# EAGLE design Bleep_Drum_Eurorack (EAGLE 7.5.0)
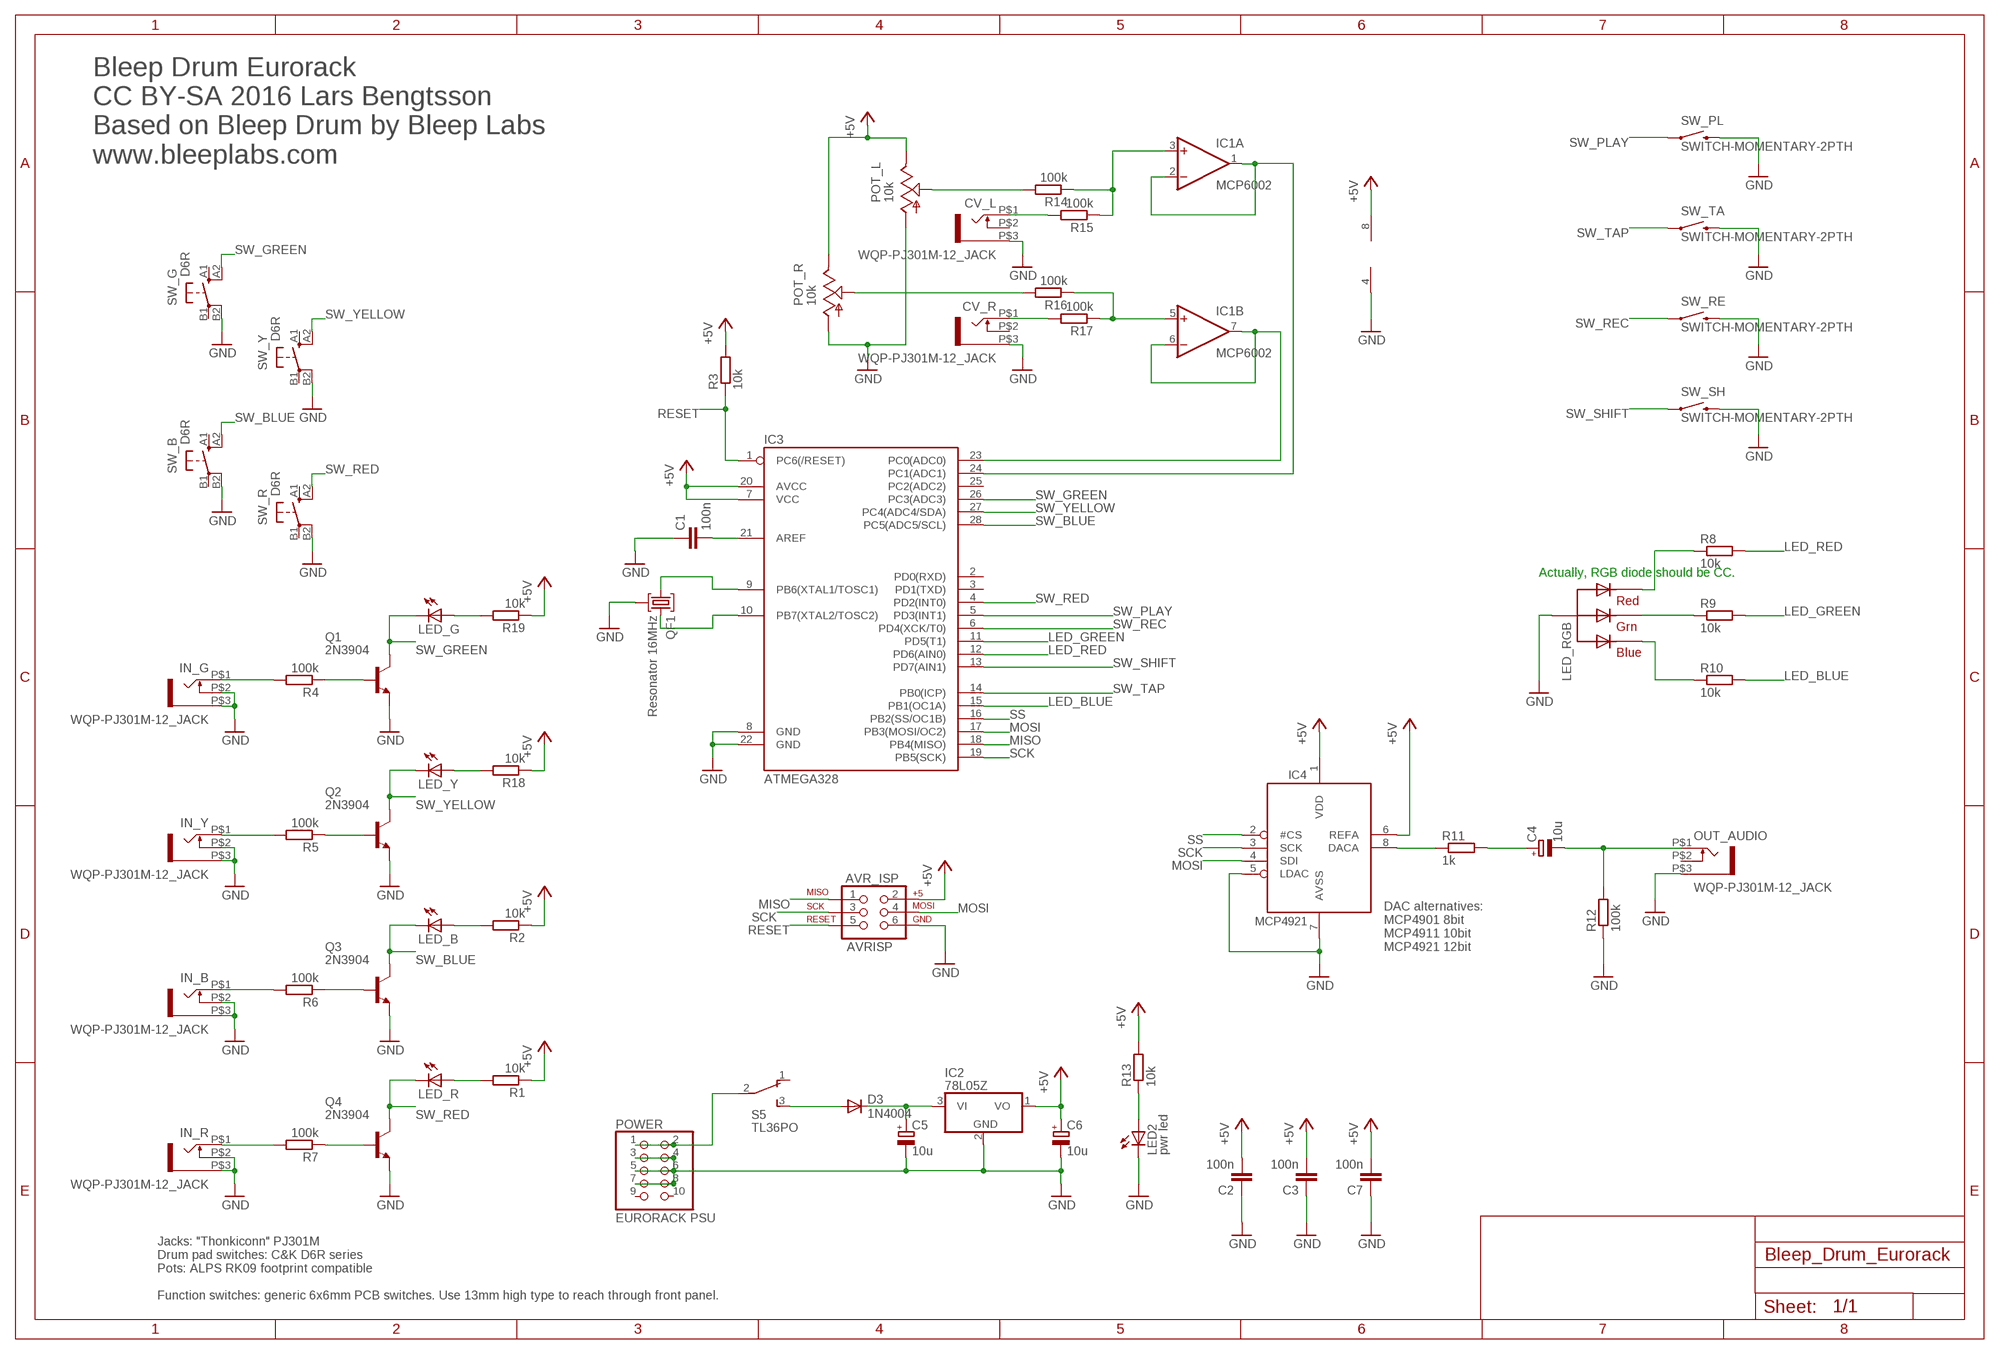
[diagram p0: schematic, sheet 1]

## Parts
AVR_ISP  AVRISP  AVR_SPI_PRG_6PTH  [2X3]
C1  100n  C-EU025-025X050  [C025-025X050]
C2  100n  C-EU025-025X050  [C025-025X050]
C3  100n  C-EU025-025X050  [C025-025X050]
C4  10u  CPOL-EUE2.5-5  [E2,5-5]
C5  10u  CPOL-EUE2.5-5  [E2,5-5]
C6  10u  CPOL-EUE2.5-5  [E2,5-5]
C7  100n  C-EU025-025X050  [C025-025X050]
CV_L  WQP-PJ301M-12_JACK  [WQP-PJ301M-12_JACK]
CV_R  WQP-PJ301M-12_JACK  [WQP-PJ301M-12_JACK]
D3  1N4004  DIODE-D-2.5  [D-2.5]
IC1  MCP6002  TL072P  [DIL08]
IC2  78L05Z  [TO92]
IC3  ATMEGA328  ATMEGA328P_PDIP  [DIL28-3]
IC4  MCP4921  MCP4921DIP8  [DIL08]
IN_B  WQP-PJ301M-12_JACK  [WQP-PJ301M-12_JACK]
IN_G  WQP-PJ301M-12_JACK  [WQP-PJ301M-12_JACK]
IN_R  WQP-PJ301M-12_JACK  [WQP-PJ301M-12_JACK]
IN_Y  WQP-PJ301M-12_JACK  [WQP-PJ301M-12_JACK]
LED2  pwr led  LED3MM  [LED3MM]
LED_B  LED3MM  [LED3MM]
LED_G  LED3MM  [LED3MM]
LED_R  LED3MM  [LED3MM]
LED_RGB  RGBLED_CA-5MM  [LED5MMRGB]
LED_Y  LED3MM  [LED3MM]
OUT_AUDIO  WQP-PJ301M-12_JACK  [WQP-PJ301M-12_JACK]
POT_L  10k  POT_USVERTICAL  [ALPS_POT_VERTICAL]
POT_R  10k  POT_USVERTICAL  [ALPS_POT_VERTICAL]
POWER  EURORACK PSU  PINHD-2X5  [2X05]
Q1  2N3904  [TO92]
Q2  2N3904  [TO92]
Q3  2N3904  [TO92]
Q4  2N3904  [TO92]
QF1  Resonator 16MHz  90M15AUM1  [UM1]
R1  10k  R-EU_0204/2V  [0204V]
R2  10k  R-EU_0204/2V  [0204V]
R3  10k  R-EU_0204/2V  [0204V]
R4  100k  R-EU_0204/2V  [0204V]
R5  100k  R-EU_0204/2V  [0204V]
R6  100k  R-EU_0204/2V  [0204V]
R7  100k  R-EU_0204/2V  [0204V]
R8  10k  R-EU_0204/2V  [0204V]
R9  10k  R-EU_0204/2V  [0204V]
R10  10k  R-EU_0204/2V  [0204V]
R11  1k  R-EU_0204/2V  [0204V]
R12  100k  R-EU_0204/2V  [0204V]
R13  10k  R-EU_0204/2V  [0204V]
R14  100k  R-EU_0204/2V  [0204V]
R15  100k  R-EU_0204/2V  [0204V]
R16  100k  R-EU_0204/2V  [0204V]
R17  100k  R-EU_0204/2V  [0204V]
R18  10k  R-EU_0204/2V  [0204V]
R19  10k  R-EU_0204/2V  [0204V]
S5  TL36PO  [TL3XPO]
SW_B  D6R  [D6R]
SW_G  D6R  [D6R]
SW_PL  SWITCH-MOMENTARY-2PTH  [TACTILE-PTH]
SW_R  D6R  [D6R]
SW_RE  SWITCH-MOMENTARY-2PTH  [TACTILE-PTH]
SW_SH  SWITCH-MOMENTARY-2PTH  [TACTILE-PTH]
SW_TA  SWITCH-MOMENTARY-2PTH  [TACTILE-PTH]
SW_Y  D6R  [D6R]

## Nets
+5V: AVR_ISP.2 C2.2 C3.2 C6.+ C7.2 IC1.8(P:V+) IC2.1(VO) IC3.7(VCC) IC3.20(AVCC) IC4.1(VDD) IC4.6(REFA) POT_L.P$1(E) POT_R.P$1(E) R1.1 R2.1 R3.2 R13.2 R18.1 R19.1
+12V_IN: POWER.1 POWER.2 S5.2(P)
GND: AVR_ISP.6 C1.1 C2.1 C3.1 C5.- C6.- C7.1 CV_L.P$3 CV_R.P$3 IC1.4(P:V-) IC2.2(GND) IC3.8(GND) IC3.22(GND) IC4.5(LDAC) IC4.7(AVSS) IN_B.P$2 IN_B.P$3 IN_G.P$2 IN_G.P$3 IN_R.P$2 IN_R.P$3 IN_Y.P$2 IN_Y.P$3 LED2.K(C) LED_RGB.2(VCC) OUT_AUDIO.P$3 POT_L.P$3(A) POT_R.P$3(A) POWER.3 POWER.4 POWER.5 POWER.6 POWER.7 POWER.8 Q1.3(E) Q2.3(E) Q3.3(E) Q4.3(E) QF1.2 R12.1 SW_B.B2(P1) SW_G.B2(P1) SW_PL.3 SW_R.B2(P1) SW_RE.3 SW_SH.3 SW_TA.3 SW_Y.B2(P1)
LED_BLUE: IC3.15(PB1(OC1A)) R10.2
LED_GREEN: IC3.11(PD5(T1)) R9.2
LED_RED: IC3.12(PD6(AIN0)) R8.2
MISO: AVR_ISP.1 IC3.18(PB4(MISO))
MOSI: AVR_ISP.4 IC3.17(PB3(MOSI/OC2)) IC4.4(SDI)
N$1: C4.+ R11.2
N$2: IC4.8(DACA) R11.1
N$3: C4.- OUT_AUDIO.P$1 R12.2
N$4: C5.+ D3.C IC2.3(VI)
N$5: IC3.9(PB6(XTAL1/TOSC1)) QF1.1
N$6: IC3.10(PB7(XTAL2/TOSC2)) QF1.3
N$7: LED_RGB.1(RED) R8.1
N$8: C1.2 IC3.21(AREF)
N$9: IN_Y.P$1 R5.2
N$10: Q2.2(B) R5.1
N$11: LED_R.A R1.2
N$12: IC1.1(A:OUT) IC1.2(A:-IN) IC3.24(PC1(ADC1))
N$13: LED_RGB.3(GREEN) R9.1
N$14: Q1.2(B) R4.1
N$15: IN_G.P$1 R4.2
N$16: LED_RGB.4(BLUE) R10.1
N$17: D3.A S5.3(S)
N$18: Q3.2(B) R6.1
N$19: IN_B.P$1 R6.2
N$20: IN_R.P$1 R7.2
N$21: Q4.2(B) R7.1
N$22: LED2.A R13.1
N$23: LED_B.A R2.2
N$24: LED_Y.A R18.2
N$25: LED_G.A R19.2
N$26: POT_L.P$2(S) R14.2
N$27: IC1.3(A:+IN) R14.1 R15.1
N$28: CV_L.P$1 R15.2
N$29: POT_R.P$2(S) R16.2
N$30: IC1.5(B:+IN) R16.1 R17.1
N$31: CV_R.P$1 R17.2
N$33: IC1.6(B:-IN) IC1.7(B:OUT) IC3.23(PC0(ADC0))
RESET: AVR_ISP.5 IC3.1(PC6(/RESET)) R3.1
SCK: AVR_ISP.3 IC3.19(PB5(SCK)) IC4.3(SCK)
SS: IC3.16(PB2(SS/OC1B)) IC4.2(#CS)
SW_BLUE: IC3.28(PC5(ADC5/SCL)) LED_B.K(C) Q3.1(C) SW_B.A2(S1)
SW_GREEN: IC3.26(PC3(ADC3)) LED_G.K(C) Q1.1(C) SW_G.A2(S1)
SW_PLAY: IC3.5(PD3(INT1)) SW_PL.1
SW_REC: IC3.6(PD4(XCK/T0)) SW_RE.1
SW_RED: IC3.4(PD2(INT0)) LED_R.K(C) Q4.1(C) SW_R.A2(S1)
SW_SHIFT: IC3.13(PD7(AIN1)) SW_SH.1
SW_TAP: IC3.14(PB0(ICP)) SW_TA.1
SW_YELLOW: IC3.27(PC4(ADC4/SDA)) LED_Y.K(C) Q2.1(C) SW_Y.A2(S1)
Unconnected: CV_L.P$2 CV_R.P$2 IC3.2(PD0(RXD)) IC3.3(PD1(TXD)) IC3.25(PC2(ADC2)) OUT_AUDIO.P$2 POWER.9 POWER.10 S5.1(O) SW_B.A1(S) SW_B.B1(P) SW_G.A1(S) SW_G.B1(P) SW_R.A1(S) SW_R.B1(P) SW_Y.A1(S) SW_Y.B1(P)

## Notes on the sheet
- Bleep Drum Eurorack
  CC BY-SA 2016 Lars Bengtsson
  Based on Bleep Drum by Bleep Labs
  www.bleeplabs.com
- Actually, RGB diode should be CC.
- DAC alternatives:
  MCP4901 8bit
  MCP4911 10bit
  MCP4921 12bit
- Jacks: "Thonkiconn" PJ301M
  Drum pad switches: C&K D6R series
  Pots: ALPS RK09 footprint compatible
  
  Function switches: generic 6x6mm PCB switches. Use 13mm high type to reach through front panel.

## Library data of the parts
AVR_ISP = SparkFun:AVR_SPI_PRG_6: AVR ISP 6 Pin This is the reduced ISP connector for AVR programming. Common on Arduino. This footprint will take up less PCB space and can be used with a 10-pin to 6-pin adapter such as SKU: BOB-08508
C1-C3 C7 = rcl:C-EU: CAPACITOR, European symbol
C4-C6 = rcl:CPOL-EU: POLARIZED CAPACITOR, European symbol
CV_L CV_R IN_B IN_G IN_R IN_Y OUT_AUDIO = thonkiconn:WQP-PJ301M-12_JACK
D3 = diode:DIODE-: DIODE
IC1 = linear:TL072: OP AMP
IC2 = linear:78*: Positive VOLTAGE REGULATOR Source: http://cache.national.com/ds/LM/LM78L05.pdf http://www.fairchildsemi.com/ds/LM/LM7805.pdf
IC3 = SparkFun-DigitalIC:ATMEGA328P_PDIP: uC used in the Arduino 32kb flash, 1k EEPROM, 2k SRAM This is the through-hole version of this chip.
IC4 = adafruit_mcp:MCP4921
LED2 LED_B LED_G LED_R LED_Y = led:LED: LED OSRAM: - CHIPLED LG R971, LG N971, LY N971, LG Q971, LY Q971, LO R971, LY R971 LH N974, LH R974 LS Q976, LO Q976, LY Q976 LO Q996 - Hyper CHIPLED LW Q18S LB Q993, LB Q99A, LB R99A - SideLED LS A670, LO A670, LY A670, LG A670, LP A670 LB A673, LV A673, LT A673, LW A673 LH A674 LY A675 LS A676, LA A676, LO A676, LY A676, LW A676 LS A679, LY A679, LG A679 - Hyper Micro SIDELED® LS Y876, LA Y876, LO Y876, LY Y876 LT Y87S - SmartLED LW L88C, LW L88S LB L89C, LB L89S, LG L890 LS L89K, LO L89K, LY L89K LS L896, LA L896, LO L896, LY L896 - TOPLED LS T670, LO T670, LY T670, LG T670, LP T670 LSG T670, LSP T670, LSY T670, LOP T670, LYG T670 LG T671, LOG T671, LSG T671 LB T673, LV T673, LT T673, LW T673 LH T674 LS T676, LA T676, LO T676, LY T676, LB T676, LH T676, LSB T676, LW T676 LB T67C, LV T67C, LT T67C, LS T67K, LO T67K, LY T67K, LW E67C LS E67B, LA E67B, LO E67B, LY E67B, LB E67C, LV E67C, LT E67C LW T67C LS T679, LY T679, LG T679 LS T770, LO T770, LY T770, LG T770, LP T770 LB T773, LV T773, LT T773, LW T773 LH T774 LS E675, LA E675, LY E675, LS T675 LS T776, LA T776, LO T776, LY T776, LB T776 LHGB T686 LT T68C, LB T68C - Hyper Mini TOPLED® LB M676 - Mini TOPLED Santana® LG M470 LS M47K, LO M47K, LY M47K Source: http://www.osram.convergy.de LUXEON: - LUMILED® LXK2-PW12-R00, LXK2-PW12-S00, LXK2-PW14-U00, LXK2-PW14-V00 LXK2-PM12-R00, LXK2-PM12-S00, LXK2-PM14-U00 LXK2-PE12-Q00, LXK2-PE12-R00, LXK2-PE12-S00, LXK2-PE14-T00, LXK2-PE14-U00 LXK2-PB12-K00, LXK2-PB12-L00, LXK2-PB12-M00, LXK2-PB14-N00, LXK2-PB14-P00, LXK2-PB14-Q00 LXK2-PR12-L00, LXK2-PR12-M00, LXK2-PR14-Q00, LXK2-PR14-R00 LXK2-PD12-Q00, LXK2-PD12-R00, LXK2-PD12-S00 LXK2-PH12-R00, LXK2-PH12-S00 LXK2-PL12-P00, LXK2-PL12-Q00, LXK2-PL12-R00 Source: www.luxeon.com KINGBRIGHT: KA-3528ASYC Source: www.kingbright.com
LED_RGB = adafruit:RGBLED_CA: RGB LED, common-anode 5MM Staggered pins 5mm Piranha package http://www.ladyada.net/library/pcb/eaglelibrary.html
POT_L POT_R = pot-alps:POT_US
POWER = pinhead:PINHD-2X5: PIN HEADER
Q1-Q4 = transistor-npn:2N3904: NPN Transistor
QF1 = crystal:90M15A: Monolithic Crystal Filters Source: www.vanlong.com; OC_FARNELL: unknown; OC_NEWARK: unknown
R1-R19 = rcl:R-EU_: RESISTOR, European symbol
S5 = switch:TL36PO: TINY SWITCH ON - ON Source: http://www2.produktinfo.conrad.com/datenblaetter/700000-724999/705152-da-01-de-Subminiaturschalter_TL_36YO.pdf
SW_B SW_G SW_R SW_Y = og-switch-CK_D6R:D6R: C&K D6R
SW_PL SW_RE SW_SH SW_TA = SparkFun-Electromechanical:SWITCH-MOMENTARY-2: Various NO switches- pushbuttons, reed, etc; PROD_ID: SWCH-08441

## Board
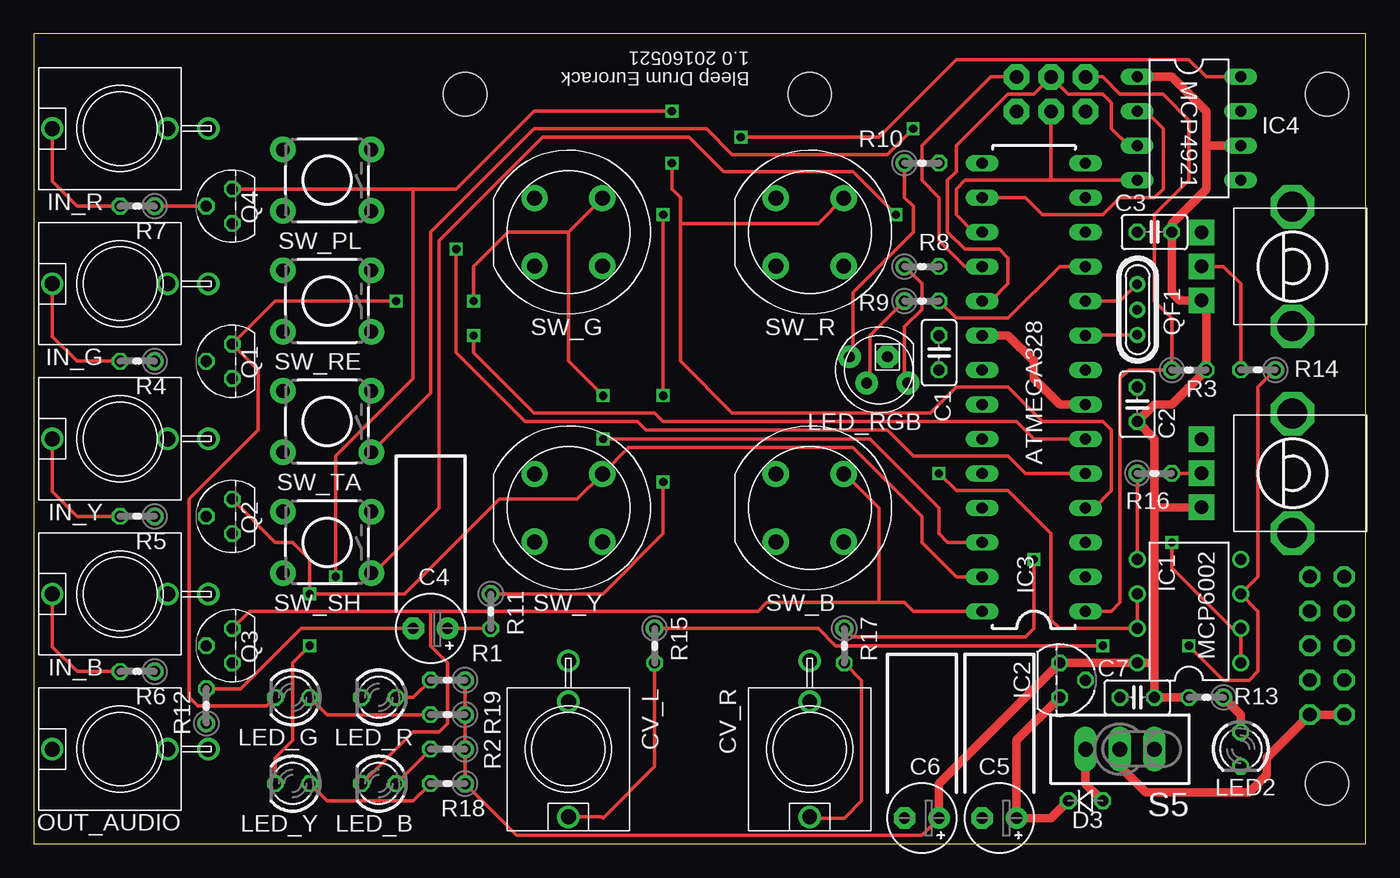
[diagram p1: board, top side]
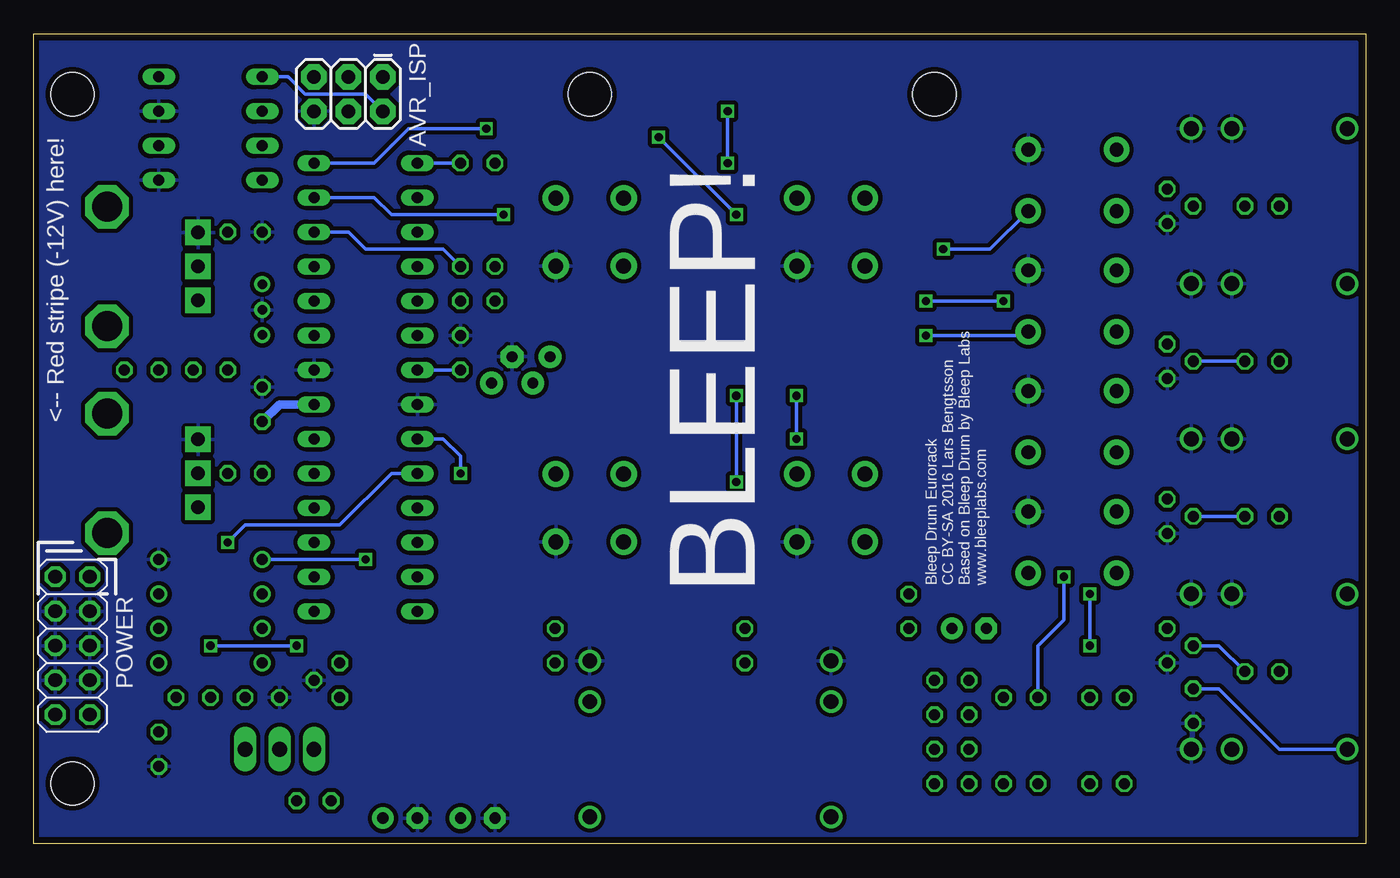
[diagram p2: board, bottom side, seen from below]

Size 98.09 x 59.68 mm. Coordinates in mm from the lower left corner, seen from the top.
Outline: 0,0 98.09,0 98.09,59.68 0,59.68 0,0
Copper layers (1*16): Top 0.0356mm / dielectric 1.5011mm / Bottom 0.0356mm
Design rules "LaenPCBOrder": minimum track width 6mil, minimum drill 13mil, track to track 6mil, track to pad 6mil, pad to pad 6mil, via to via 6mil, smd to smd 6mil, copper to edge 15mil, drill to drill 6mil, minimum pad ring 7mil, minimum via ring 7mil, stop-mask expansion 3mil, vias tented up to drill 0mil, thermal gap 10mil
Holes 3.2 mm at 31.75,55.25 57.15,55.25 95.25,4.45 95.25,55.25

### Footprints (pad centres in the part's own frame; a part is rotated, then mirrored left to right if it is on the bottom)
2X3 = drill 1.016 pad 1.88 octagon: 1 0,0; 2 0,2.54; 3 2.54,0; 4 2.54,2.54; 5 5.08,0; 6 5.08,2.54
C025-025X050 = drill 0.813 octagon: 1 -1.27,0; 2 1.27,0
E2,5-5 = drill 0.813 pad 1.6: + -1.27,0 | drill 0.813 pad 1.6 octagon: - 1.27,0
WQP-PJ301M-12_JACK = drill 1.1: P$1 0,5; P$2 0,-3.5; P$3 0,-6.5
D-2.5 = drill 0.813 octagon: A 1.27,0; C -1.27,0
DIL08 = drill 0.813 pad 1.27: 1 -3.81,-3.81; 2 -1.27,-3.81; 3 1.27,-3.81; 4 3.81,-3.81; 5 3.81,3.81; 6 1.27,3.81; 7 -1.27,3.81; 8 -3.81,3.81
TO92 = drill 0.813 octagon: 1 -1.27,0; 2 0,1.905; 3 1.27,0
DIL28-3 = drill 0.813 long: 1 -16.51,-3.81; 2 -13.97,-3.81; 3 -11.43,-3.81; 4 -8.89,-3.81; 5 -6.35,-3.81; 6 -3.81,-3.81; 7 -1.27,-3.81; 8 1.27,-3.81; 9 3.81,-3.81; 10 6.35,-3.81; 11 8.89,-3.81; 12 11.43,-3.81; 13 13.97,-3.81; 14 16.51,-3.81; 15 16.51,3.81; 16 13.97,3.81; 17 11.43,3.81; 18 8.89,3.81; 19 6.35,3.81; 20 3.81,3.81; 21 1.27,3.81; 22 -1.27,3.81; 23 -3.81,3.81; 24 -6.35,3.81; 25 -8.89,3.81; 26 -11.43,3.81; 27 -13.97,3.81; 28 -16.51,3.81
DIL08' = drill 0.813 long: 1 -3.81,-3.81; 2 -1.27,-3.81; 3 1.27,-3.81; 4 3.81,-3.81; 5 3.81,3.81; 6 1.27,3.81; 7 -1.27,3.81; 8 -3.81,3.81
LED3MM = drill 0.813 octagon: A -1.27,0; K 1.27,0
LED5MMRGB = drill 0.8 pad 1.676: 1 -2.159,0.968; 3 0.889,0.968; 4 2.159,-0.968 | drill 0.8 pad 1.676 octagon: 2 -0.635,-0.968
ALPS_POT_VERTICAL = drill 1 pad 1.88 square: P$1 -2.5,6.7; P$2 0,6.7; P$3 2.5,6.7 | drill 2.2 pad 3.175 octagon: P$4 -4.4,0; P$5 4.4,0
2X05 = drill 1.016 octagon: 1 -5.08,-1.27; 2 -5.08,1.27; 3 -2.54,-1.27; 4 -2.54,1.27; 5 0,-1.27; 6 0,1.27; 7 2.54,-1.27; 8 2.54,1.27; 9 5.08,-1.27; 10 5.08,1.27
TO92' = drill 0.813 octagon: 1 1.27,0; 2 0,1.905; 3 -1.27,0
UM1 = drill 0.7 pad 1.2: 1 -1.875,0; 2 -0.027,0; 3 1.875,0
0204V = drill 0.813 octagon: 1 -1.27,0; 2 1.27,0
TL3XPO = drill 1.1 pad 1.422 long: 1 -2.54,0; 2 0,0; 3 2.54,0
D6R = drill 1.1 pad 1.93: A1 -2.5,2.5; A2 2.5,2.5; B1 -2.5,-2.5; B2 2.5,-2.5
TACTILE-PTH = drill 1.016 pad 1.88: 1 -3.251,2.261; 2 3.251,2.261; 3 -3.251,-2.261; 4 3.251,-2.261

### Placement (x,y rotation side)
AVR_ISP  72.39,56.52 180 bottom
C1  66.67,36.19 270 top
C2  81.28,32.39 270 top
C3  82.55,45.08 0 top
C4  29.21,15.88 180 top
C5  71.12,1.91 180 top
C6  65.41,1.91 180 top
C7  81.28,10.8 0 top
CV_L  39.37,6.98 180 top
CV_R  57.15,6.98 180 top
D3  77.47,3.18 0 top
IC1  85.09,17.14 90 top
IC2  75.56,12.07 270 top
IC3  73.66,33.66 90 top
IC4  MCP4921  [DIL08']  85.09,52.7 270 top
IN_B  6.35,18.41 90 top
IN_G  6.35,41.28 90 top
IN_R  6.35,52.7 90 top
IN_Y  6.35,29.85 90 top
LED2  88.9,6.98 270 top
LED_B  25.4,4.45 180 top
LED_G  19.05,10.8 180 top
LED_R  25.4,10.8 180 top
LED_RGB  62.23,34.92 180 top
LED_Y  19.05,4.45 180 top
OUT_AUDIO  6.35,6.98 90 top
POT_L  92.71,42.55 90 top
POT_R  92.71,27.31 90 top
POWER  95.25,14.61 90 bottom
Q1  2N3904  [TO92']  14.61,35.56 90 top
Q2  2N3904  [TO92']  14.61,24.13 90 top
Q3  2N3904  [TO92']  14.61,14.61 90 top
Q4  2N3904  [TO92']  14.61,46.99 90 top
QF1  81.28,39.37 90 top
R1  30.48,12.07 180 top
R2  30.48,6.98 180 top
R3  85.09,34.92 0 top
R4  7.62,35.56 180 top
R5  7.62,24.13 180 top
R6  7.62,12.7 180 top
R7  7.62,46.99 180 top
R8  65.41,42.55 0 top
R9  65.41,40 0 top
R10  65.41,50.17 0 top
R11  33.65,17.14 270 top
R12  12.7,10.16 90 top
R13  86.36,10.8 180 top
R14  90.17,34.92 180 top
R15  45.72,14.61 270 top
R16  82.55,27.31 0 top
R17  59.69,14.61 270 top
R18  30.48,4.45 180 top
R19  30.48,9.53 180 top
S5  80.01,6.98 180 top
SW_B  57.15,24.77 0 top
SW_G  39.37,45.08 0 top
SW_PL  21.59,48.89 180 top
SW_R  57.15,45.08 0 top
SW_RE  21.59,40 180 top
SW_SH  21.59,22.23 180 top
SW_TA  21.59,31.11 180 top
SW_Y  39.37,24.77 0 top

### Tracks (layer width: path | path; a pad name or v marks a point on that pad's centre or on a via)
+5V
  Top 0.254: R1.1 R19.1 R2.1 R18.1 35.56,0.63 65.41,0.63 C6.+
  Top 0.61: C6.+ 66.67,4.45 IC2.1 IC1.8 82.55,13.34 | 82.55,13.34 82.55,24.77 82.59,24.8 | POT_R.P$1 82.59,24.8 | 82.59,24.8 82.55,24.84 82.55,29.85 C2.2 82.55,32.39 83.82,32.39 R3.2 86.36,39.69 POT_L.P$1 84.42,40.05 83.82,40.64 C3.2 83.82,45.72 86.36,48.26 86.36,51.44 | R13.2 C7.2 82.55,13.34 | 86.36,51.44 IC4.6 | 86.36,51.44 86.36,53.97 83.82,56.52 IC4.1 | IC3.20 71.76,37.47 73.66,35.56 73.66,34.29 75.56,32.39 IC3.7
  Bottom 0.254: AVR_ISP.2 73.66,55.25 78.11,55.25 79.38,56.52 IC4.1
  Bottom 0.61: C2.2 80.01,32.39 IC3.7
+12V_IN
  Top 0.61: POWER.2 POWER.1 90.81,6.35 90.81,5.08 89.54,3.81 81.92,3.81 80.01,5.71 S5.2
GND
  pour Bottom (isolate 0.305): 0.64,59.05 97.79,59.05 97.79,0.63 0.64,0.63
LED_BLUE
  Bottom 0.254: IC3.15 R10.2
LED_GREEN
  Top 0.254: IC3.11 75.56,42.55 71.76,38.73 67.95,38.73 R9.2
LED_RED
  Bottom 0.254: R8.2 67.95,43.81 73.66,43.81 74.93,45.08 IC3.12
MISO
  Top 0.254: IC3.18 68.58,42.55 66.67,44.45 66.67,47.62 65.41,48.89 65.41,51.44 70.48,56.52 AVR_ISP.1
MOSI
  Top 0.254: IC3.17 69.22,45.08 67.95,46.36 67.95,48.26 68.58,48.89 74.93,48.89 | 74.93,48.89 IC4.4 | AVR_ISP.4 74.93,48.89
N$1
  Top 0.254: C4.+ R11.2
N$2  (via drill 0.6)
  Top 0.254: v52.07,52.07 62.23,52.07 67.95,57.78 85.09,57.78 86.36,56.52 IC4.8 | v46.35,46.36 v46.35,33.02 | v46.35,26.67 46.35,22.86 41.91,18.41 R11.1
  Bottom 0.254: v52.07,52.07 v46.35,46.36 | v46.35,33.02 v46.35,26.67
N$3
  Top 0.254: R12.2 15.24,11.43 19.68,15.88 C4.-
  Bottom 0.254: R12.2 10.79,11.43 6.35,6.98 OUT_AUDIO.P$1
N$4
  Top 0.61: D3.C 74.93,1.91 C5.+ 72.39,7.62 IC2.3
N$5
  Top 0.254: QF1.1 77.5,37.5 IC3.9
N$6
  Top 0.254: QF1.3 81.25,41.25 80.01,40 IC3.10
N$7
  Top 0.254: R8.1 65.41,41.28 65.41,39.37 64.14,38.1 64.14,34.21 LED_RGB.1
N$8
  Bottom 0.254: IC3.21 C1.2
N$9
  Top 0.254: IN_Y.P$1 1.35,25.96 3.18,24.13 R5.2
N$10
  Bottom 0.254: Q2.2 R5.1
N$11
  Top 0.254: LED_R.A 27.94,10.8 R1.2
N$12  (via drill 0.6)
  Top 0.254: IC1.1 IC1.2 88.27,15.88 83.82,20.32 v83.82,22.23
  Bottom 0.254: IC3.24 71.76,27.31 75.56,23.5 82.55,23.5 v83.82,22.23
N$13
  Top 0.254: R9.1 61.59,37.47 61.59,34.21 LED_RGB.3
N$14
  Bottom 0.254: Q1.2 R4.1
N$15
  Top 0.254: IN_G.P$1 1.35,37.39 3.18,35.56 R4.2
N$16
  Top 0.254: R10.1 64.14,47.62 64.77,46.99 64.77,45.08 60.32,40.64 60.32,36.15 LED_RGB.4
N$17
  Top 0.61: S5.3 77.47,4.45 D3.A
N$18
  Bottom 0.254: Q3.2 10.79,14.61 R6.1
N$19
  Top 0.254: IN_B.P$1 1.35,14.52 3.18,12.7 R6.2
N$20
  Top 0.254: IN_R.P$1 1.35,48.81 3.18,46.99 R7.2
N$21
  Top 0.254: R7.1 Q4.2
N$22
  Top 0.61: R13.1 88.9,9.53 LED2.A
N$23
  Top 0.254: R2.2 LED_B.A
N$24
  Top 0.254: R18.2 27.94,3.18 21.59,3.18 LED_Y.A
N$25
  Top 0.254: R19.2 21.59,9.53 LED_G.A
N$26
  Top 0.254: POT_L.P$2 87.63,42.55 88.9,41.28 R14.2
N$27  (via drill 0.6)
  Top 0.254: R15.1 57.78,15.88 59.05,14.61 v78.74,14.61 | R14.1 90.17,33.66 90.17,19.68 IC1.3 90.17,17.14 90.17,12.7 89.54,12.07 87.63,12.07 v85.09,14.61
  Bottom 0.254: v85.09,14.61 v78.74,14.61
N$28
  Top 0.254: CV_L.P$1 41.83,1.99 41.91,1.91 45.72,5.71 R15.2
N$29
  Top 0.254: POT_R.P$2 R16.2
N$30  (via drill 0.6)
  Top 0.254: R16.1 IC1.5 | v73.66,20.96 73.66,15.88 73.03,15.24 60.32,15.24 R17.1
  Bottom 0.254: IC1.5 v73.66,20.96
N$31
  Top 0.254: R17.2 60.96,12.07 60.96,3.18 59.69,1.91 57.23,1.91 CV_R.P$1
N$33  (via drill 0.6)
  Top 0.254: IC1.6 IC1.7 75.56,15.88 74.93,16.51 74.93,22.86 71.76,26.04 67.95,26.04 v66.67,27.31
  Bottom 0.254: v66.67,27.31 66.67,28.57 67.95,29.85 IC3.23
RESET
  Top 0.254: IC3.1 79.38,17.14 80.01,17.78 80.01,34.29 80.65,34.92 R3.1 83.82,38.73 82.55,40 82.55,46.36 85.09,48.89 85.09,53.34 83.19,55.25 80.01,55.25 78.74,56.52 AVR_ISP.5
SCK
  Top 0.254: IC3.19 70.48,40 71.76,41.28 71.76,43.18 71.12,43.81 68.58,43.81 67.31,45.08 67.31,48.89 67.95,49.53 67.95,51.44 71.76,55.25 73.66,55.25 AVR_ISP.3 76.2,55.25 78.74,55.25 79.38,54.61 79.38,52.7 80.65,51.44 IC4.3
SS
  Top 0.254: IC4.2 81.92,53.97 83.19,52.7 83.19,48.26 82.55,47.62 80.01,47.62 78.74,46.36 74.3,46.36 73.03,47.62 IC3.16
SW_BLUE
  Top 0.254: Q3.1 15.88,17.14 29.21,17.14 | IC3.28 64.77,17.14 64.14,17.78 62.23,17.78 | 62.23,17.78 53.97,17.78 53.34,17.14 29.21,17.14 | SW_B.A2 59.73,27.26 62.23,24.77 62.23,17.78 | LED_B.K 27.94,8.26 29.84,8.26 30.48,8.89 30.48,13.34 29.21,14.61 29.21,17.14
SW_GREEN  (via drill 0.6)
  Top 0.254: v26.67,40 17.78,40 Q1.1 16.51,34.92 16.51,30.48 11.43,25.4 11.43,10.8 12.07,10.16 17.14,10.16 LED_G.K | v32.38,40 32.38,42.55 34.92,45.08 39.37,45.08 | 39.37,45.08 SW_G.A2 | IC3.26 67.31,22.23 66.67,22.86 66.67,24.77 61.59,29.85 v41.91,29.85 | v41.91,33.02 39.37,35.56 39.37,45.08
  Bottom 0.254: v26.67,40 v32.38,40 | v41.91,29.85 v41.91,33.02
SW_PLAY  (via drill 0.6)
  Top 0.254: IC3.5 73.03,27.31 71.76,28.57 64.77,28.57 62.87,30.48 45.08,30.48 44.45,31.11 36.2,31.11 31.11,36.19 v31.11,43.81
  Bottom 0.254: v31.11,43.81 27.66,43.81 SW_PL.1
SW_REC  (via drill 0.6)
  Top 0.254: IC3.6 73.66,29.85 72.39,31.11 46.35,31.11 45.72,31.75 36.83,31.75 32.38,36.19 v32.38,37.47
  Bottom 0.254: v32.38,37.47 25.12,37.47 SW_RE.1
SW_RED  (via drill 0.6)
  Top 0.254: IC3.4 78.11,24.77 79.38,26.04 79.38,30.48 78.74,31.11 74.3,31.11 71.76,33.66 67.95,33.66 66.04,31.75 51.43,31.75 47.62,35.56 47.62,45.72 | Q4.1 27.94,48.26 | 27.94,48.26 31.11,48.26 36.83,53.97 v46.99,53.97 | 47.62,45.72 57.78,45.72 SW_R.A2 | 47.62,45.72 47.62,47.62 46.99,48.26 v46.99,50.17 | 27.94,48.26 27.94,34.29 22.23,28.57 v22.23,19.68
  Bottom 0.254: 59.69,47.55 SW_R.A2 | v46.99,53.97 v46.99,50.17 | v22.23,19.68 22.23,16.51 24.13,14.61 LED_R.K
SW_SHIFT  (via drill 0.6)
  Top 0.254: SW_SH.1 25.04,19.96 29.84,24.77 29.84,44.45 37.46,52.07 48.26,52.07 50.8,49.53 60.32,49.53 v63.5,46.36
  Bottom 0.254: IC3.13 73.03,47.62 71.76,46.36 v63.5,46.36
SW_TAP  (via drill 0.6)
  Top 0.254: v64.77,52.7 62.87,50.8 51.43,50.8 49.53,52.7 36.83,52.7 29.21,45.08 29.21,33.22 SW_TA.1
  Bottom 0.254: IC3.14 73.03,50.17 70.48,52.7 v64.77,52.7
SW_YELLOW  (via drill 0.6)
  Top 0.254: IC3.27 67.95,19.68 65.41,22.23 65.41,24.13 60.32,29.21 43.81,29.21 SW_Y.A2 40,25.4 34.29,25.4 27.3,18.41 v20.32,18.41 20.32,20.96 19.05,22.23 17.78,22.23 Q2.1 | LED_Y.K 17.78,6.35 19.05,7.62 19.05,13.34 v20.32,14.61
  Bottom 0.254: v20.32,14.61 v20.32,18.41

### Text on the board
tPlace: Bleep Drum Eurorack / 1.0 20160521
bPlace: <-- Red stripe (-12V) here! | BLEEP! | Bleep Drum Eurorack / CC BY-SA 2016 Lars Bengtsson / Based on Bleep Drum by Bleep Labs / www.bleeplabs.com